# EasyEDA schematic SCH_Hackpad-c-pad_2026-07-27.json
TITLE: Sheet_1; REV: 1.0; Date: 2026-07-18; Sheet: 1/1; Drawn By: zorp_; Company: Your Company
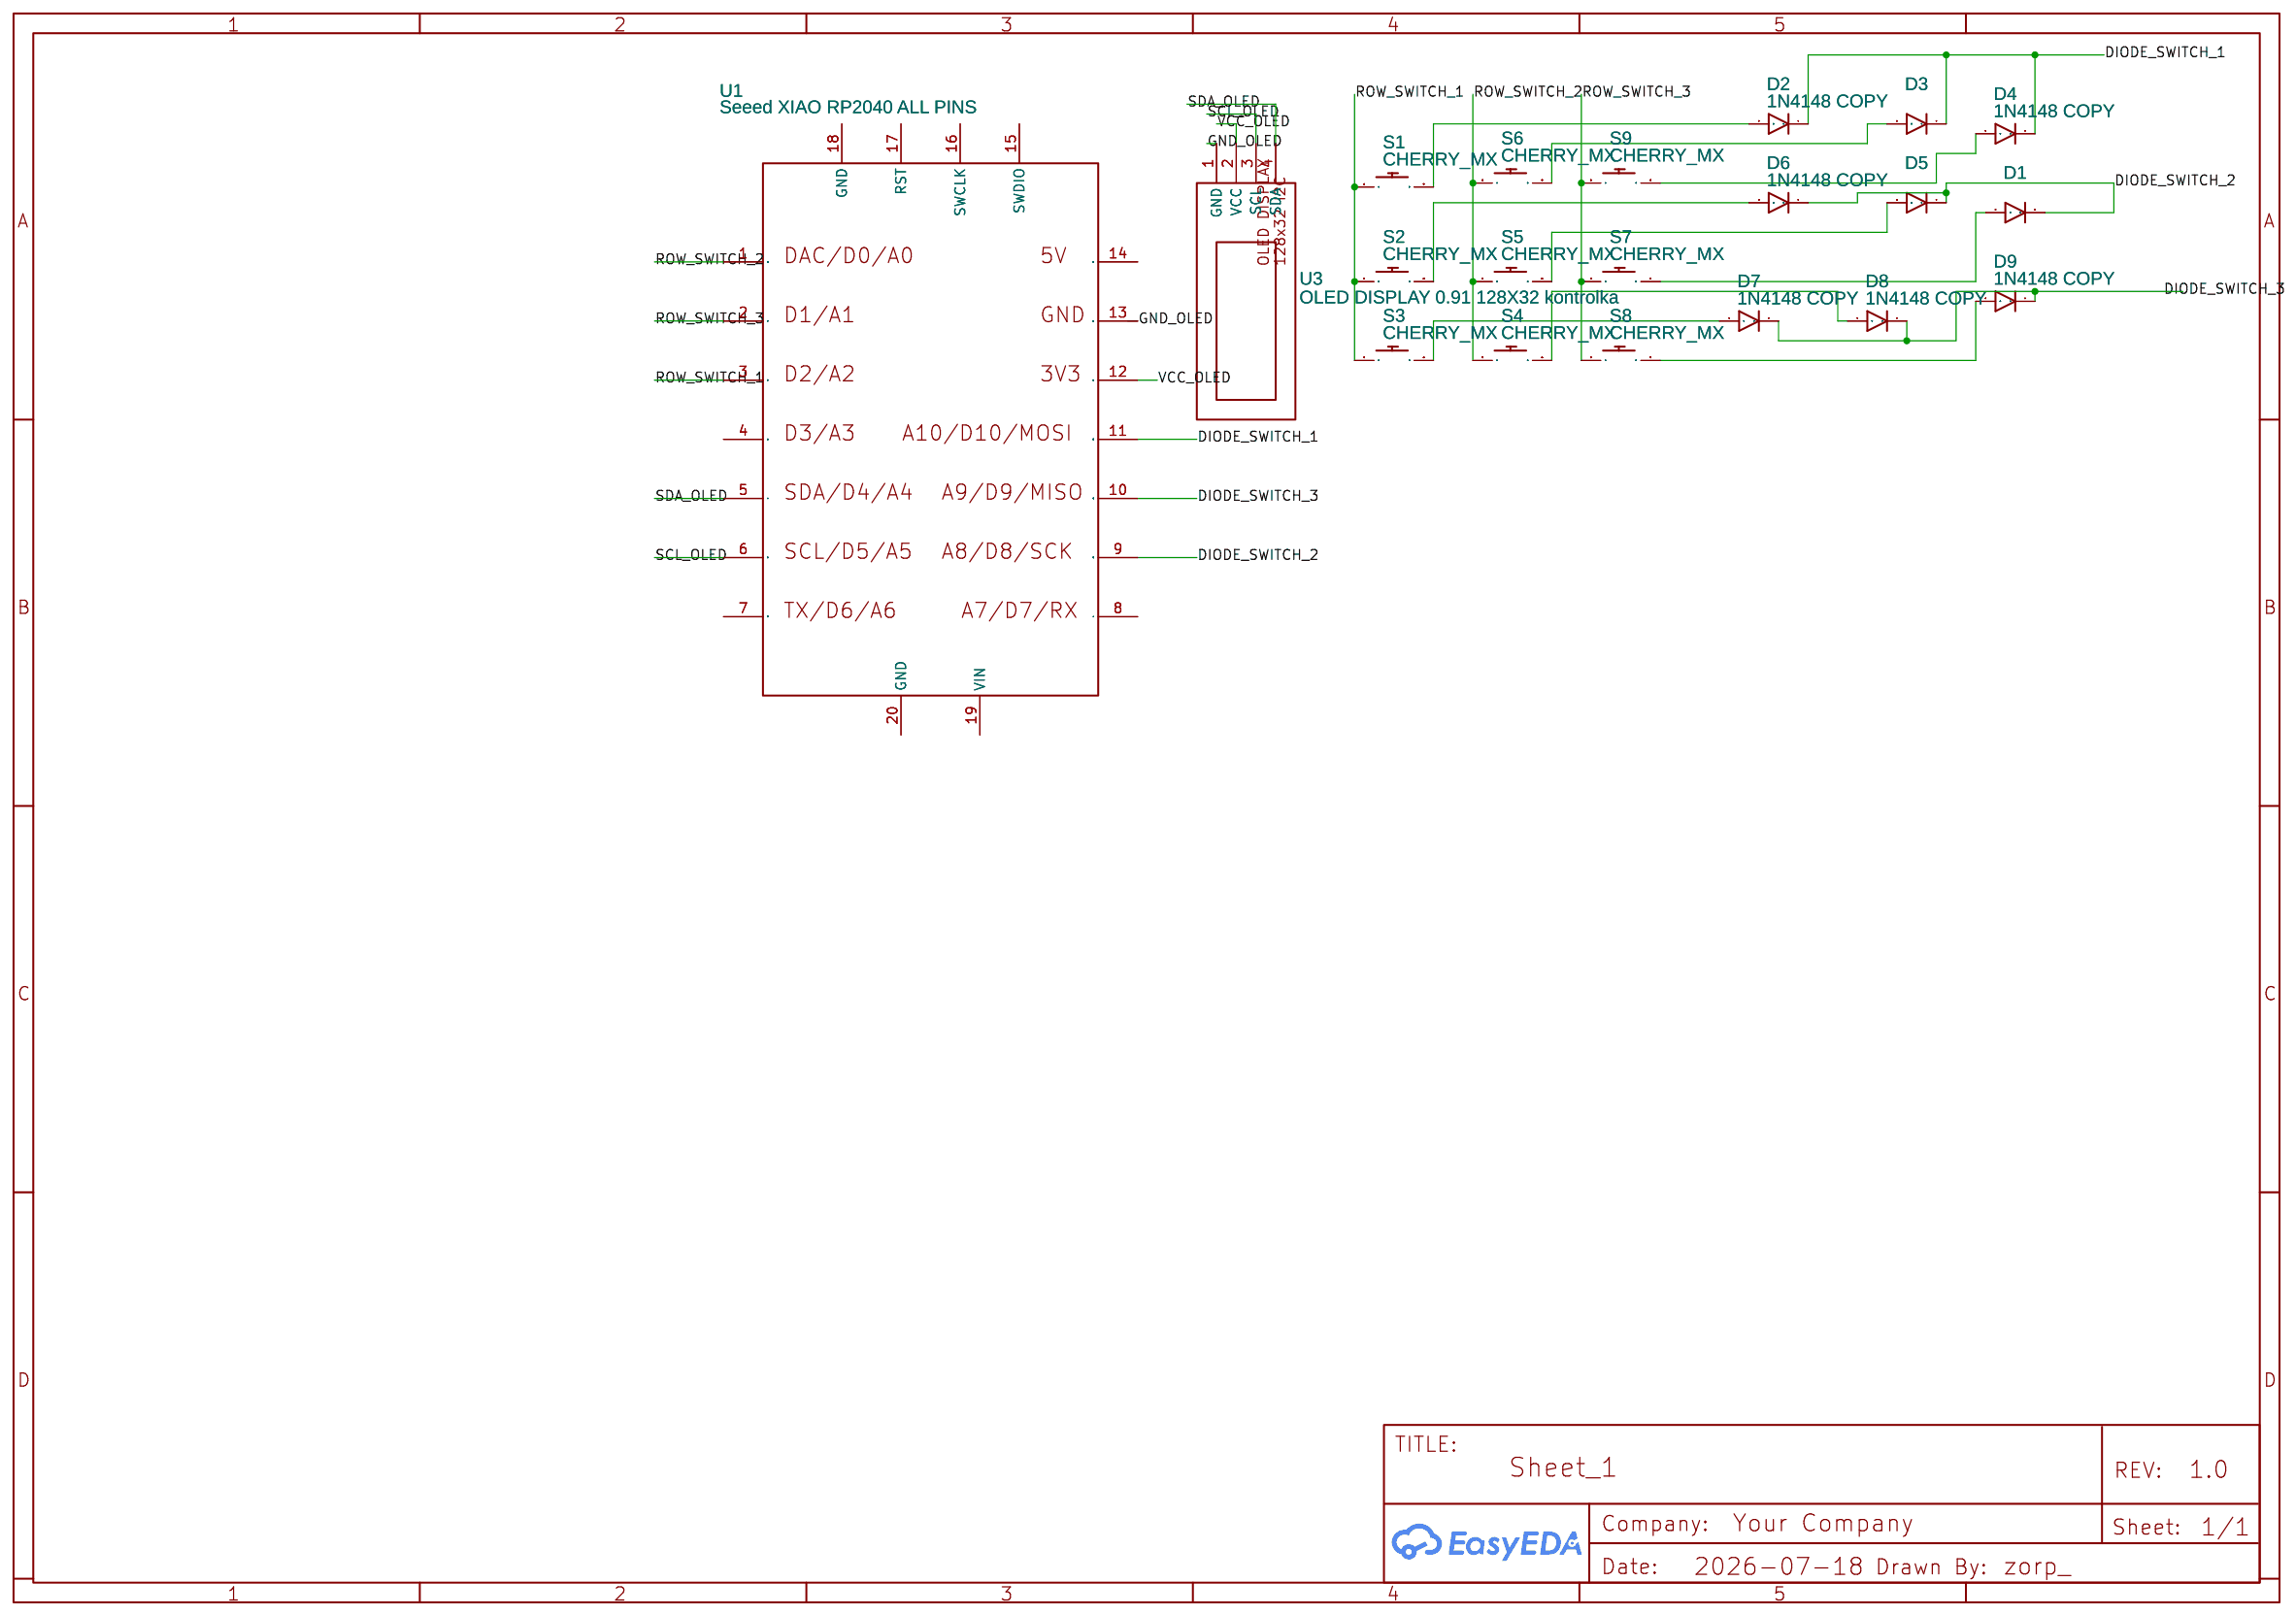
[diagram p0: schematic sheet]

## Parts
D1  1N4148 COPY  [1N4148_1N4148W]
D2  1N4148 COPY  [1N4148_1N4148W]
D3  1N4148 COPY  [1N4148_1N4148W]
D4  1N4148 COPY  [1N4148_1N4148W]
D5  1N4148 COPY  [1N4148_1N4148W]
D6  1N4148 COPY  [1N4148_1N4148W]
D7  1N4148 COPY  [1N4148_1N4148W]
D8  1N4148 COPY  [1N4148_1N4148W]
D9  1N4148 COPY  [1N4148_1N4148W]
S1  CHERRY_MX  [CHERRY_MX]
S2  CHERRY_MX  [CHERRY_MX]
S3  CHERRY_MX  [CHERRY_MX]
S4  CHERRY_MX  [CHERRY_MX]
S5  CHERRY_MX  [CHERRY_MX]
S6  CHERRY_MX  [CHERRY_MX]
S7  CHERRY_MX  [CHERRY_MX]
S8  CHERRY_MX  [CHERRY_MX]
S9  CHERRY_MX  [CHERRY_MX]
U1  Seeed XIAO RP2040 ALL PINS  [SEEED XIAO RP2040]
U3  OLED DISPLAY 0.91 128X32 kontrolka  [OLED-TH-C128-R64-D0.91-I2C-SSD1306]

## Library data of the parts
D1-D9 = 1N4148 COPY: Contributor: lkjhwnsgur
S1-S9 = CHERRY_MX: Contributor: Kyan Bateson
U1 = Seeed XIAO RP2040 ALL PINS: Manufacturer: Seeedstudio; Manufacturer Part: 102010328; link: https://www.seeedstudio.com/Seeeduino-XIAO-Arduino-Microcontroller-SAMD21-Cortex-M0+-p-4426.html; Contributor: mkyo2001
U3 = OLED DISPLAY 0.91 128X32 kontrolka: Contributor: lekm

## Nets
GND_OLED: U1.13(12) U3.1(GND)
VCC_OLED: U1.12(11) U3.2(VCC)
DIODE_SWITCH_1: D2.1 D3.1 D4.1 U1.11(10)
DIODE_SWITCH_2: D1.1 D5.1 D6.1 U1.9(8)
DIODE_SWITCH_3: D7.1 D8.1 D9.1 U1.10(9)
ROW_SWITCH_1: S1.S1(1) S2.S1(1) S3.S1(1) U1.3(2)
ROW_SWITCH_2: S4.S1(1) S5.S1(1) S6.S1(1) U1.1(0)
ROW_SWITCH_3: S7.S1(1) S8.S1(1) S9.S1(1) U1.2(1)
SCL_OLED: U1.6(5) U3.3(SCL)
SDA_OLED: U1.5(4) U3.4(SDA)
Net-(D1-2): D1.2 S7.S2(2)
Net-(D2-2): D2.2 S1.S2(2)
Net-(D3-2): D3.2 S6.S2(2)
Net-(D4-2): D4.2 S9.S2(2)
Net-(D5-2): D5.2 S5.S2(2)
Net-(D6-2): D6.2 S2.S2(2)
Net-(D7-2): D7.2 S3.S2(2)
Net-(D8-2): D8.2 S4.S2(2)
Net-(D9-2): D9.2 S8.S2(2)

Not connected (* = marked no-connect by the designer): U1 4(3) 7(6) 8(7) 14(13) 15(SWDIO) 16(SWCLK) 17(RST) 18(GND) 19(VIN) 20(GND)
